# Altium project bdFrame.PrjPCB
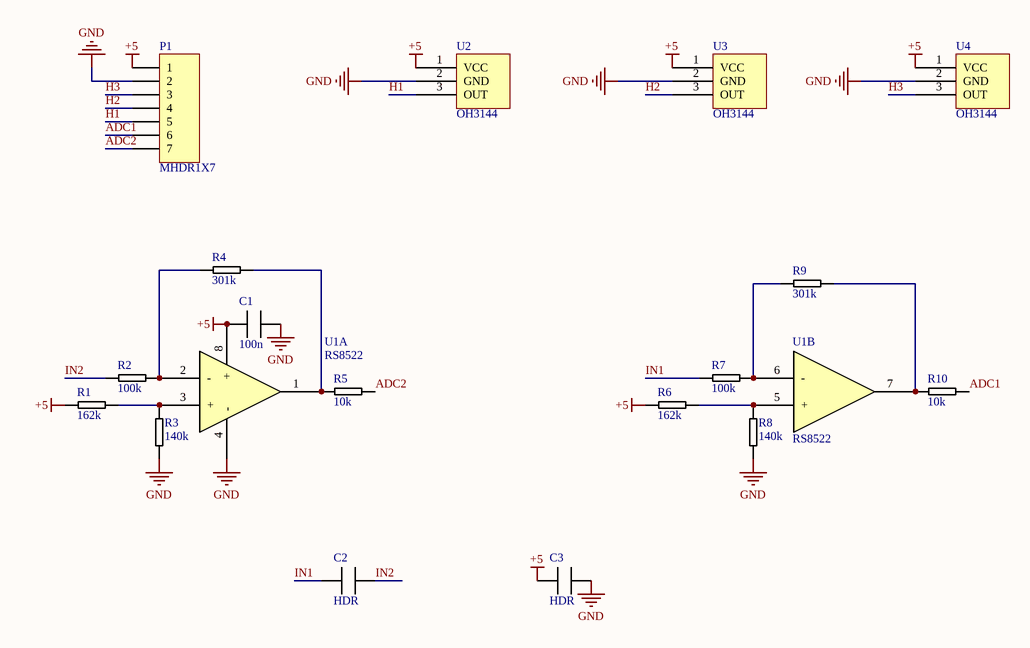
[diagram p0: Sheet2.SchDoc]
1 sheet, 18 parts. Net scope: global (net labels, ports and power ports of the same name join across sheets).
Board file: PCB1.PcbDoc

## Sheet Sheet2.SchDoc
size A4

### Parts
C1  100n  [0603]
C2  HDR  [0805]
C3  HDR  [0805]
P1  MHDR1X7  [MHDR1X7]
R1  162k  [0603]
R2  100k  [0603]
R3  140k  [0603]
R4  301k  [0603]
R5  10k  [0603]
R6  162k  [0603]
R7  100k  [0603]
R8  140k  [0603]
R9  301k  [0603]
R10  10k  [0603]
U1  RS8522  [TDFN-2x2-8L]  (parts A,B of 2)
U2  OH3144  [TO-92S]
U3  OH3144  [TO-92S]
U4  OH3144  [TO-92S]

### Nets
+5: C1.1 C3.1 P1.1 R1.1 R6.1 U1.8(+) U2.1(VCC) U3.1(VCC) U4.1(VCC)
GND: C1.2 C3.2 P1.2 R3.1 R8.1 U1.4(-) U2.2(GND) U3.2(GND) U4.2(GND)
ADC1: P1.6 R10.2
ADC2: P1.7 R5.2
H1: P1.5 U2.3(OUT)
H2: P1.4 U3.3(OUT)
H3: P1.3 U4.3(OUT)
IN1: C2.1 R7.1
IN2: C2.2 R2.1
NetR1_2: R1.2 R3.2 U1.3(+)
NetR2_2: R2.2 R4.1 U1.2(-)
NetR4_2: R4.2 R5.1 U1.1
NetR6_2: R6.2 R8.2 U1.5(+)
NetR7_2: R7.2 R9.1 U1.6(-)
NetR9_2: R9.2 R10.1 U1.7

### Library data of the parts
C1-C3 = Cap
P1 = MHDR1X7: Header, 7-Pin; LatestRevisionDate: 17-Jul-2002; LatestRevisionNote: Re-released for DXP Platform.; Publisher: Altium Limited
R1-R10 = Res